# Altium schematic sheet thymio2-main.SchDoc: Thymio2
size A4; Organization: Original design LSRO-STI-EPFL; Address1: Association Mobsya; Address2: Michael Bonani; Address3: Ch. Closel 3; Address4: CH-1020 Renens; DocumentNumber: 1; Revision: 2.3; SheetNumber: 1; SheetTotal: 9; Engineer: Michael Bonani; Title2: PCB principal; ProjectName: Project Name
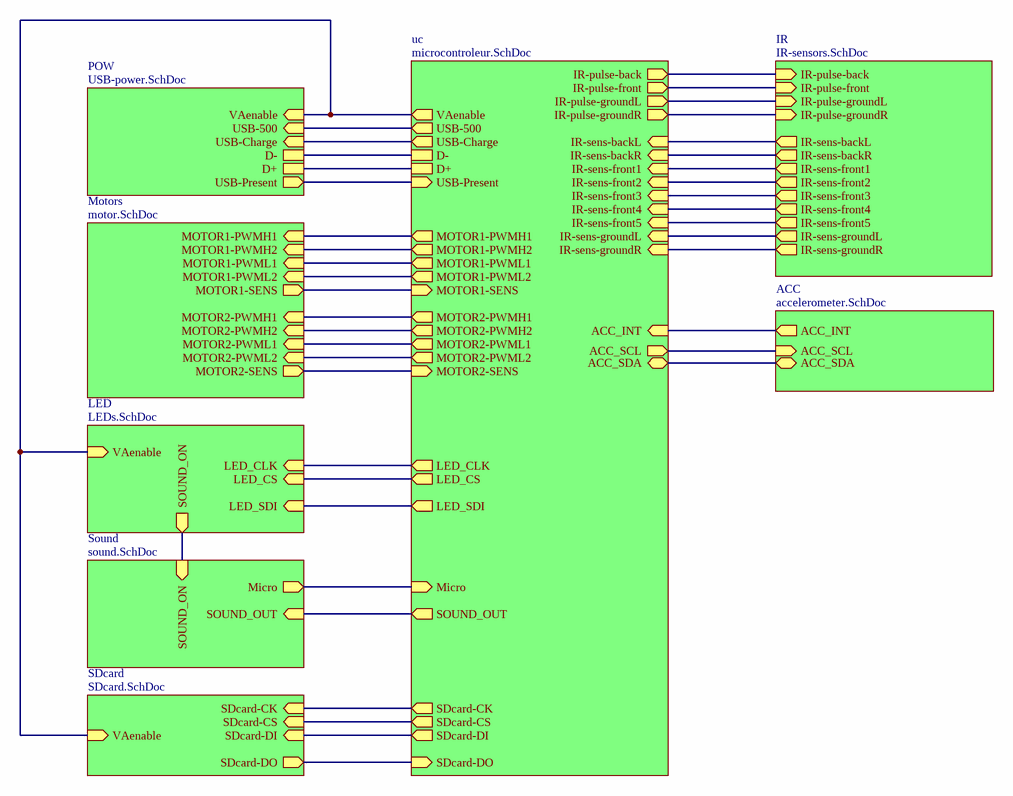
[diagram p0: thymio2-main.SchDoc]

## Sub-sheets
ACC = accelerometer.SchDoc: ACC_INT (out), ACC_SCL (in), ACC_SDA (bidir)
IR = IR-sensors.SchDoc: IR-pulse-back (in), IR-pulse-front (in), IR-pulse-groundL (in), IR-pulse-groundR (in), IR-sens-backL (out), IR-sens-backR (out), IR-sens-front1 (out), IR-sens-front2 (out), IR-sens-front3 (out), IR-sens-front4 (out), IR-sens-front5 (out), IR-sens-groundL (out), IR-sens-groundR (out)
LED = LEDs.SchDoc: LED_CLK (in), LED_CS (in), LED_SDI (in), SOUND_ON (out), VAenable (in)
Motors = motor.SchDoc: MOTOR1-PWMH1 (in), MOTOR1-PWMH2 (in), MOTOR1-PWML1 (in), MOTOR1-PWML2 (in), MOTOR1-SENS (out), MOTOR2-PWMH1 (in), MOTOR2-PWMH2 (in), MOTOR2-PWML1 (in), MOTOR2-PWML2 (in), MOTOR2-SENS (out)
POW = USB-power.SchDoc: D+, D-, USB-500 (in), VAenable (in), USB-Charge (in), USB-Present (out)
SDcard = SDcard.SchDoc: SDcard-CK (in), SDcard-CS (in), SDcard-DI (in), SDcard-DO (out), VAenable (in)
Sound = sound.SchDoc: Micro (out), SOUND_ON (in), SOUND_OUT (in)
uc = microcontroleur.SchDoc: ACC_INT (in), ACC_SCL (out), ACC_SDA (bidir), IR-pulse-back (out), IR-pulse-front (out), IR-pulse-groundL (out), IR-pulse-groundR (out), IR-sens-backL (in), IR-sens-backR (in), IR-sens-front1 (in), IR-sens-front2 (in), IR-sens-front3 (in), IR-sens-front4 (in), IR-sens-front5 (in), IR-sens-groundL (in), IR-sens-groundR (in), MOTOR1-PWMH1 (out), MOTOR1-PWMH2 (out), MOTOR1-PWML1 (out), MOTOR1-PWML2 (out), MOTOR1-SENS (in), MOTOR2-PWMH1 (out), MOTOR2-PWMH2 (out), MOTOR2-PWML1 (out), MOTOR2-PWML2 (out), MOTOR2-SENS (in), D+, D-, USB-500 (out), VAenable (out), LED_CLK (out), LED_CS (out), LED_SDI (out), USB-Charge (out), Micro (in), SOUND_OUT (out), SDcard-CK (out), SDcard-CS (out), SDcard-DI (out), SDcard-DO (in), USB-Present (in)

## Nets
(unnamed): sheet uc/ACC_INT, sheet ACC/ACC_INT
(unnamed): sheet uc/ACC_SCL, sheet ACC/ACC_SCL
(unnamed): sheet uc/ACC_SDA, sheet ACC/ACC_SDA
(unnamed): sheet uc/IR-pulse-back, sheet IR/IR-pulse-back
(unnamed): sheet uc/IR-pulse-front, sheet IR/IR-pulse-front
(unnamed): sheet uc/IR-pulse-groundL, sheet IR/IR-pulse-groundL
(unnamed): sheet uc/IR-pulse-groundR, sheet IR/IR-pulse-groundR
(unnamed): sheet uc/IR-sens-backL, sheet IR/IR-sens-backL
(unnamed): sheet uc/IR-sens-backR, sheet IR/IR-sens-backR
(unnamed): sheet uc/IR-sens-front1, sheet IR/IR-sens-front1
(unnamed): sheet uc/IR-sens-front2, sheet IR/IR-sens-front2
(unnamed): sheet uc/IR-sens-front3, sheet IR/IR-sens-front3
(unnamed): sheet uc/IR-sens-front4, sheet IR/IR-sens-front4
(unnamed): sheet uc/IR-sens-front5, sheet IR/IR-sens-front5
(unnamed): sheet uc/IR-sens-groundL, sheet IR/IR-sens-groundL
(unnamed): sheet uc/IR-sens-groundR, sheet IR/IR-sens-groundR
(unnamed): sheet uc/MOTOR1-PWMH1, sheet Motors/MOTOR1-PWMH1
(unnamed): sheet uc/MOTOR1-PWMH2, sheet Motors/MOTOR1-PWMH2
(unnamed): sheet uc/MOTOR1-PWML1, sheet Motors/MOTOR1-PWML1
(unnamed): sheet uc/MOTOR1-PWML2, sheet Motors/MOTOR1-PWML2
(unnamed): sheet uc/MOTOR1-SENS, sheet Motors/MOTOR1-SENS
(unnamed): sheet uc/MOTOR2-PWMH1, sheet Motors/MOTOR2-PWMH1
(unnamed): sheet uc/MOTOR2-PWMH2, sheet Motors/MOTOR2-PWMH2
(unnamed): sheet uc/MOTOR2-PWML1, sheet Motors/MOTOR2-PWML1
(unnamed): sheet uc/MOTOR2-PWML2, sheet Motors/MOTOR2-PWML2
(unnamed): sheet uc/MOTOR2-SENS, sheet Motors/MOTOR2-SENS
(unnamed): sheet uc/D+, sheet POW/D+
(unnamed): sheet uc/D-, sheet POW/D-
(unnamed): sheet uc/USB-500, sheet POW/USB-500
(unnamed): sheet uc/VAenable, sheet POW/VAenable, sheet LED/VAenable, sheet SDcard/VAenable
(unnamed): sheet uc/LED_CLK, sheet LED/LED_CLK
(unnamed): sheet uc/LED_CS, sheet LED/LED_CS
(unnamed): sheet uc/LED_SDI, sheet LED/LED_SDI
(unnamed): sheet uc/USB-Charge, sheet POW/USB-Charge
(unnamed): sheet uc/Micro, sheet Sound/Micro
(unnamed): sheet uc/SOUND_OUT, sheet Sound/SOUND_OUT
(unnamed): sheet uc/SDcard-CK, sheet SDcard/SDcard-CK
(unnamed): sheet uc/SDcard-CS, sheet SDcard/SDcard-CS
(unnamed): sheet uc/SDcard-DI, sheet SDcard/SDcard-DI
(unnamed): sheet uc/SDcard-DO, sheet SDcard/SDcard-DO
(unnamed): sheet uc/USB-Present, sheet POW/USB-Present
(unnamed): sheet LED/SOUND_ON, sheet Sound/SOUND_ON

## Notes on the sheet
- Date:
- Project
- Part
- Revision:
- File :
- Page
- de